# Altium schematic sheet Mech_Interface_Port_Deployable.SchDoc: Mech_Interface_Port_Deployable
size Letter; Author: Nicholas J. Sorensen, and Erik F. Halliwell; Engineer: Nicholas J. Sorensen, and Erik F. Halliwell; DocumentNumber: 7; SheetNumber: 7; SheetTotal: 8
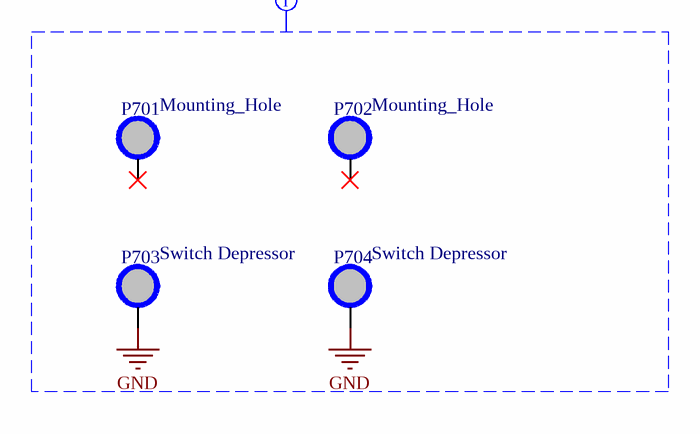
[diagram p0: Mech_Interface_Port_Deployable.SchDoc]

## Parts
P701  Mounting_Hole  [DepHinge_Mounting_Hole]
P702  Mounting_Hole  [DepHinge_Mounting_Hole]
P703  Switch Depressor  [Switch_Depressor]
P704  Switch Depressor  [Switch_Depressor]

## Nets
GND: P703.1 P704.1

Not connected (* = marked no-connect by the designer): P701 1(0)*; P702 1(0)*

## Layout directives
mark named Mounting: GND

## Notes on the sheet
- (the "License"); you may not use or redistribute this file except in compliance with the License. You
- This file and the information within it are licensed under the terms of the Apache License, Version 2.0
- Copyright
- Unless required by applicable law or agreed to in writing, content distributed under the License is
- distributed on an "AS IS" BASIS, WITHOUT WARRANTIES OR CONDITIONS OF ANY KIND,
- either express or implied. See the License for the specific language governing permissions and
- limitations under the License.
- may obtain a copy of the License at:
- http://www.apache.org/licenses/LICENSE-2.0
- Title
- Size:
- Date:
- Letter
- Number:
- Time:
- Revision:
- Sheet
- of
- University of Alberta
- Deptartment of Electrical
- and Computer Engineering
- Edmonton AB, Canada
- T6G 1H9
- File:

## Library data of the parts
P701 P702 = PXX-ABS-00003: Depolyable Hinge Mounting hole.; Index: 3; Part Number: PXX-ABS-00003; Manufacturer Part Number: N/A; Supplier Part Number 1: N/A; Supplier 1: N/A; Publisher: AlbertaSat; LatestRevisionNote: ...; PackageReference: P?
P703 P704 = PXX-ABS-00005: Hardware for depressing the switch; Manufacturer Part Number: Custom; Index: 5; Designator: P?; Part Number: PXX-ABS-00005; Supplier 1: Digi-key; Publisher: AlbertaSat; LatestRevisionNote: ...